# EAGLE design h2oiq_rev2 (EAGLE 6.3)
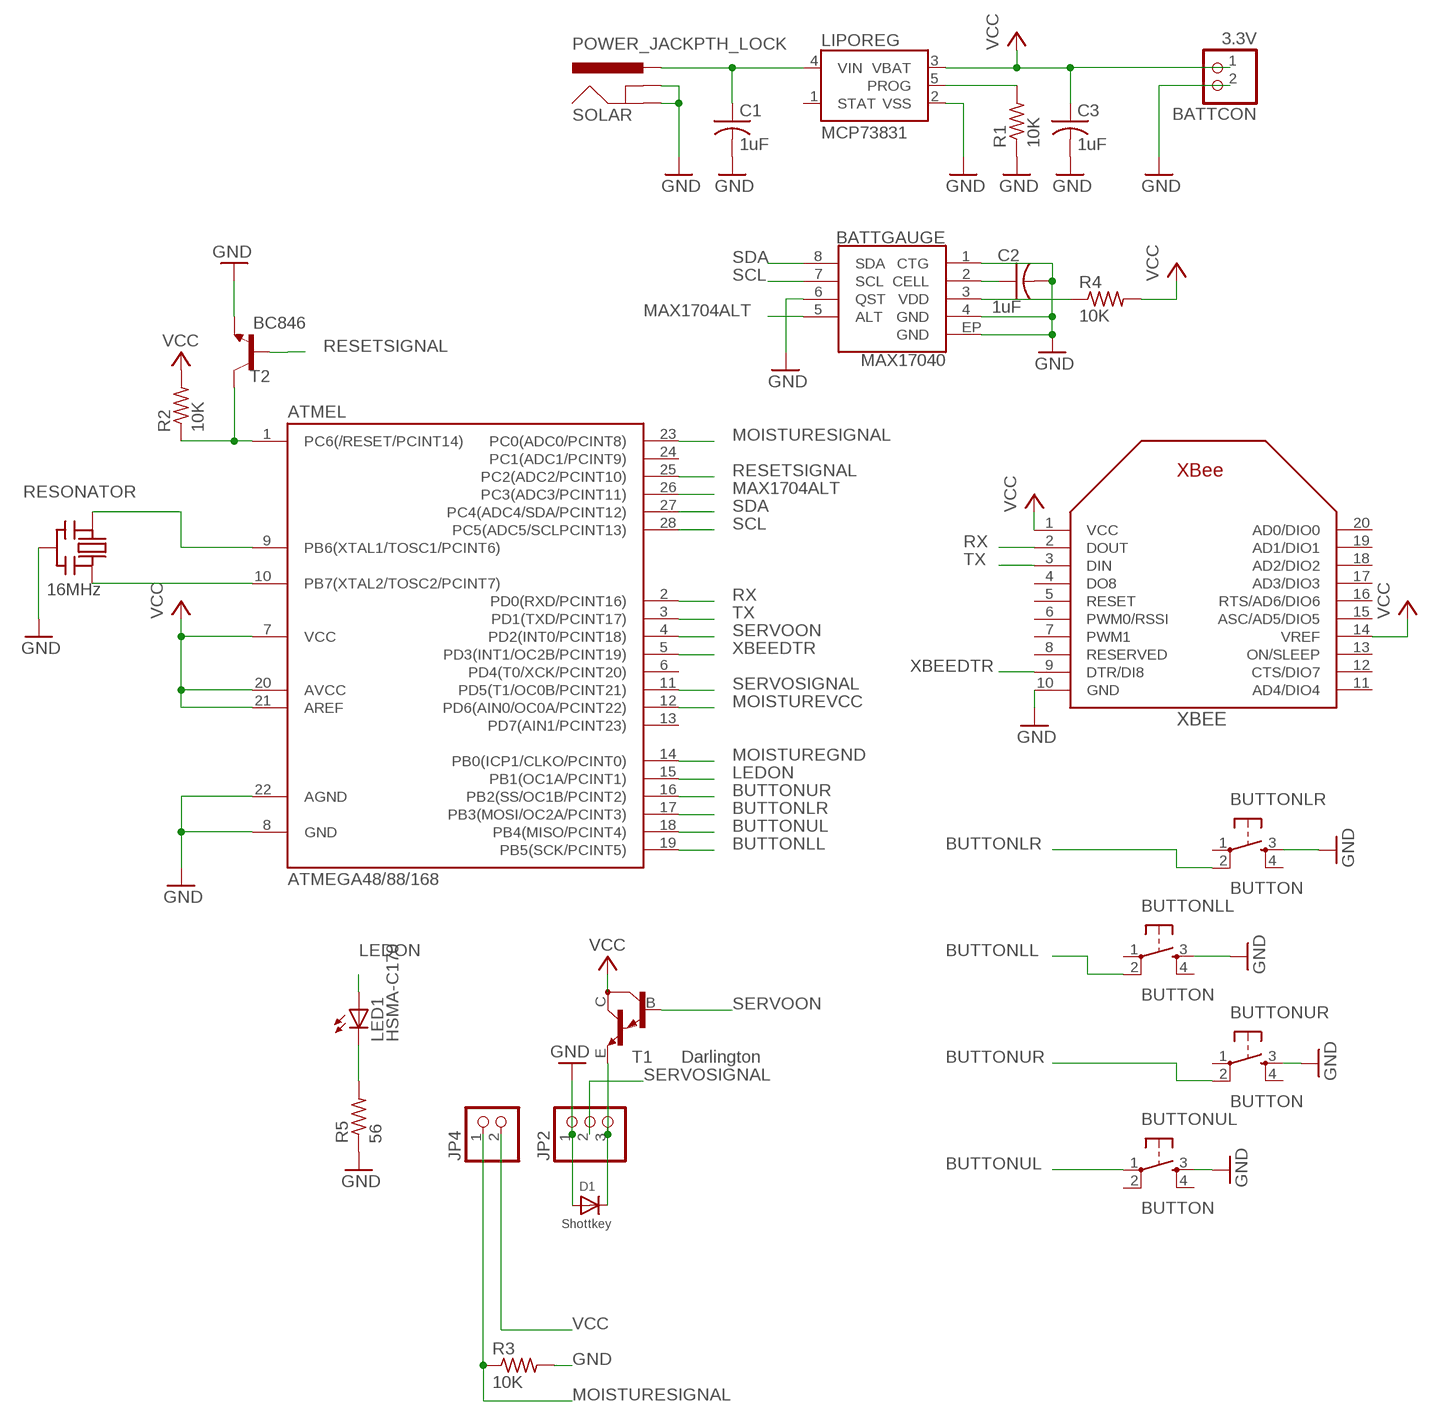
[diagram p0: schematic, sheet 1]

## Parts
ATMEL  ATMEGA48/88/168  MEGA48/88/168-PU  [DIL28-3]
BATTCON  3.3V  JST_2PIN-THM  [JST-PH-2-THM]
BATTGAUGE  MAX17040  [MAX17040-TFDN]
BUTTONLL  BUTTON  TAC_SWITCHPTH  [TACTILE-PTH]
BUTTONLR  BUTTON  TAC_SWITCHPTH  [TACTILE-PTH]
BUTTONUL  BUTTON  TAC_SWITCHPTH  [TACTILE-PTH]
BUTTONUR  BUTTON  TAC_SWITCHPTH  [TACTILE-PTH]
C1  1uF  C-USC0603K  [C0603K]
C2  1uF  C-USC0603K  [C0603K]
C3  1uF  C-USC0603K  [C0603K]
D1  Shottkey  DIODESMA  [SMADIODE]
JP2  PINHD-1X3  [1X03]
JP4  PINHD-1X2  [1X02]
LED1  HSMA-C170  LED-HSMA-C170  [LED-HSMA-SMD]
LIPOREG  MCP73831  [SOT23-5]
R1  10K  R-US_R0805  [R0805]
R2  10K  R-US_R0805  [R0805]
R3  10K  R-US_R0805  [R0805]
R4  10K  R-US_R0805  [R0805]
R5  56  R-US_R0805  [R0805]
RESONATOR  16MHz  CERMOSCILL-THM  [CERM_OSC]
SOLAR  POWER_JACKPTH_LOCK  [POWER_JACK_PTH_LOCK]
T1  Darlington  MMBTA13LT1-NPN_DARL-SOT23-BEC  [SOT23-BEC]
T2  BC846  [SOT23]
XBEE  XBEE  [XBEE]

## Nets
BUTTONLL: ATMEL.19(PB5(SCK/PCINT5)) BUTTONLL.2
BUTTONLR: ATMEL.17(PB3(MOSI/OC2A/PCINT3)) BUTTONLR.2
BUTTONUL: ATMEL.18(PB4(MISO/PCINT4)) BUTTONUL.1
BUTTONUR: ATMEL.16(PB2(SS/OC1B/PCINT2)) BUTTONUR.2
GND: ATMEL.8(GND) ATMEL.22(AGND) BATTCON.2 BATTGAUGE.1(CTG) BATTGAUGE.4(GND) BATTGAUGE.6(QST) BATTGAUGE.EP(GND) BUTTONLL.3 BUTTONLR.3 BUTTONUL.3 BUTTONUR.3 C1.2 C2.2 C3.2 D1.A JP2.1 LIPOREG.2(VSS) R1.1 R3.2 R5.1 RESONATOR.P$2(GND) SOLAR.GND SOLAR.GNDBREAK T2.2(E) XBEE.10(GND)
LEDON: ATMEL.15(PB1(OC1A/PCINT1)) LED1.P$1(A)
MAX1704ALT: ATMEL.26(PC3(ADC3/PCINT11)) BATTGAUGE.5(ALT)
MOISTUREGND: ATMEL.14(PB0(ICP1/CLKO/PCINT0))
MOISTURESIGNAL: ATMEL.23(PC0(ADC0/PCINT8)) JP4.1 R3.1
MOISTUREVCC: ATMEL.12(PD6(AIN0/OC0A/PCINT22))
N$1: BATTGAUGE.3(VDD) R4.1
N$2: LIPOREG.5(PROG) R1.2
N$3: ATMEL.1(PC6(/RESET/PCINT14)) R2.1 T2.3(C)
N$4: ATMEL.10(PB7(XTAL2/TOSC2/PCINT7)) RESONATOR.P$3(OUT)
N$6: ATMEL.9(PB6(XTAL1/TOSC1/PCINT6)) RESONATOR.P$1(IN)
N$11: LED1.P$2(C) R5.2
N$23: BATTGAUGE.2(CELL) C2.1
RESETSIGNAL: ATMEL.25(PC2(ADC2/PCINT10)) T2.1(B)
RX: ATMEL.2(PD0(RXD/PCINT16)) XBEE.2(DOUT)
SCL: ATMEL.28(PC5(ADC5/SCLPCINT13)) BATTGAUGE.7(SCL)
SDA: ATMEL.27(PC4(ADC4/SDA/PCINT12)) BATTGAUGE.8(SDA)
SERVOACT: D1.C JP2.3 T1.E
SERVOON: ATMEL.4(PD2(INT0/PCINT18)) T1.B
SERVOSIGNAL: ATMEL.11(PD5(T1/OC0B/PCINT21)) JP2.2
TX: ATMEL.3(PD1(TXD/PCINT17)) XBEE.3(DIN)
VCC: ATMEL.7(VCC) ATMEL.20(AVCC) ATMEL.21(AREF) BATTCON.1 C3.1 JP4.2 LIPOREG.3(VBAT) R2.2 R4.2 T1.C XBEE.1(VCC) XBEE.14(VREF)
VIN: C1.1 LIPOREG.4(VIN) SOLAR.PWR
XBEEDTR: ATMEL.5(PD3(INT1/OC2B/PCINT19)) XBEE.9(DTR/DI8)
Unconnected: ATMEL.6(PD4(T0/XCK/PCINT20)) ATMEL.13(PD7(AIN1/PCINT23)) ATMEL.24(PC1(ADC1/PCINT9)) BUTTONLL.1 BUTTONLL.4 BUTTONLR.1 BUTTONLR.4 BUTTONUL.2 BUTTONUL.4 BUTTONUR.1 BUTTONUR.4 LIPOREG.1(STAT) XBEE.4(DO8) XBEE.5(RESET) XBEE.6(PWM0/RSSI) XBEE.7(PWM1) XBEE.8(RESERVED) XBEE.11(AD4/DIO4) XBEE.12(CTS/DIO7) XBEE.13(ON/SLEEP) XBEE.15(ASC/AD5/DIO5) XBEE.16(RTS/AD6/DIO6) XBEE.17(AD3/DIO3) XBEE.18(AD2/DIO2) XBEE.19(AD1/DIO1) XBEE.20(AD0/DIO0)

## Library data of the parts
ATMEL = avr-4:MEGA48/88/168-PU
BATTCON = adafruit:JST_2PIN: JST 2-Pin Connectors of various flavors SMT-RA (S2B-PH-SM4) 4UConnector #17311 SMT (B2B-PH-SM4) THM-RA (S2B-PH) THM (B2B-PH)
BATTGAUGE = fuge_h20iq:MAX17040: LiPo Charge Regulator MAX17040 Maxim Integrated Products - TFDN-8 Package Source: http://datasheets.maximintegrated.com/en/ds/MAX17040-MAX17041.pdf
BUTTONLL BUTTONLR BUTTONUL BUTTONUR = SparkFun:TAC_SWITCH: Momentary Switch Button commonly used for reset or general input. Spark Fun Electronics SKU : COM-00097
C1-C3 = rcl:C-US: CAPACITOR, American symbol
D1 = adafruit:DIODE: Diode SMADIODE - SMA Surface Mount Package 20V 1A Schottky Diode Digikey: 641-1014-6-ND DO-1N4148 - Through Hole Small Current Diode SOD-123 20V 1 A (.5mV Vf) Schottky Diode - Digikey: MBRX120TPMSCT-ND SOD-323 10V 570mA (.38mV Vf, 3ns) Schottky Diode - Digikey: ZLLS410CT-ND SOD-523 30V 30mA Schottky Diode (RB751S-40TE61) - Digikey: RB751S-40TE61CT-ND SOT23-R/W - SOT23 Package (R = Solder Paste/Reflow Ovens, W = Hand-Soldering) BAT54Film 40V 300mA - Digikey: 497-7162-1-ND
JP2 = pinhead:PINHD-1X3: PIN HEADER
JP4 = pinhead:PINHD-1X2: PIN HEADER
LED1 = fuge_h20iq:LED-HSMA-C170: LED-HSMA Source: http://www.avagotech.com/docs/AV02-0112EN
LIPOREG = SparkFun:MCP73831: Microchip's MCP73831 Miniature single cell, fully integrated Li-Ion, Li-polymer charge management controller http://ww1.microchip.com/downloads/en/DeviceDoc/21984a.pdf
R1-R5 = resistor:R-US_: RESISTOR, American symbol
RESONATOR = adafruit:CERMOSCILL: Ceramic oscillator with built in capacitors such as ZTT-12MHz http://www.ladyada.net/library/eagle
SOLAR = SparkFun:POWER_JACK: Power Jack This is the standard 5.5mm barrel jack for power. The PTH is the most common, proven, reliable, footprint. All others are experimental. The Slot footprint only works if the mill layer is transmitted to the PCB fab house so be warned. Spark Fun Electronics SKU : PRT-00119. Mating wall wart : TOL-00298 (and others)
T1 = transistor:*-NPN_DARL-: NPN Darlington Transistor
T2 = transistor:BC846: NPN TRANSISTOR
XBEE = adafruit:XBEE

## Board
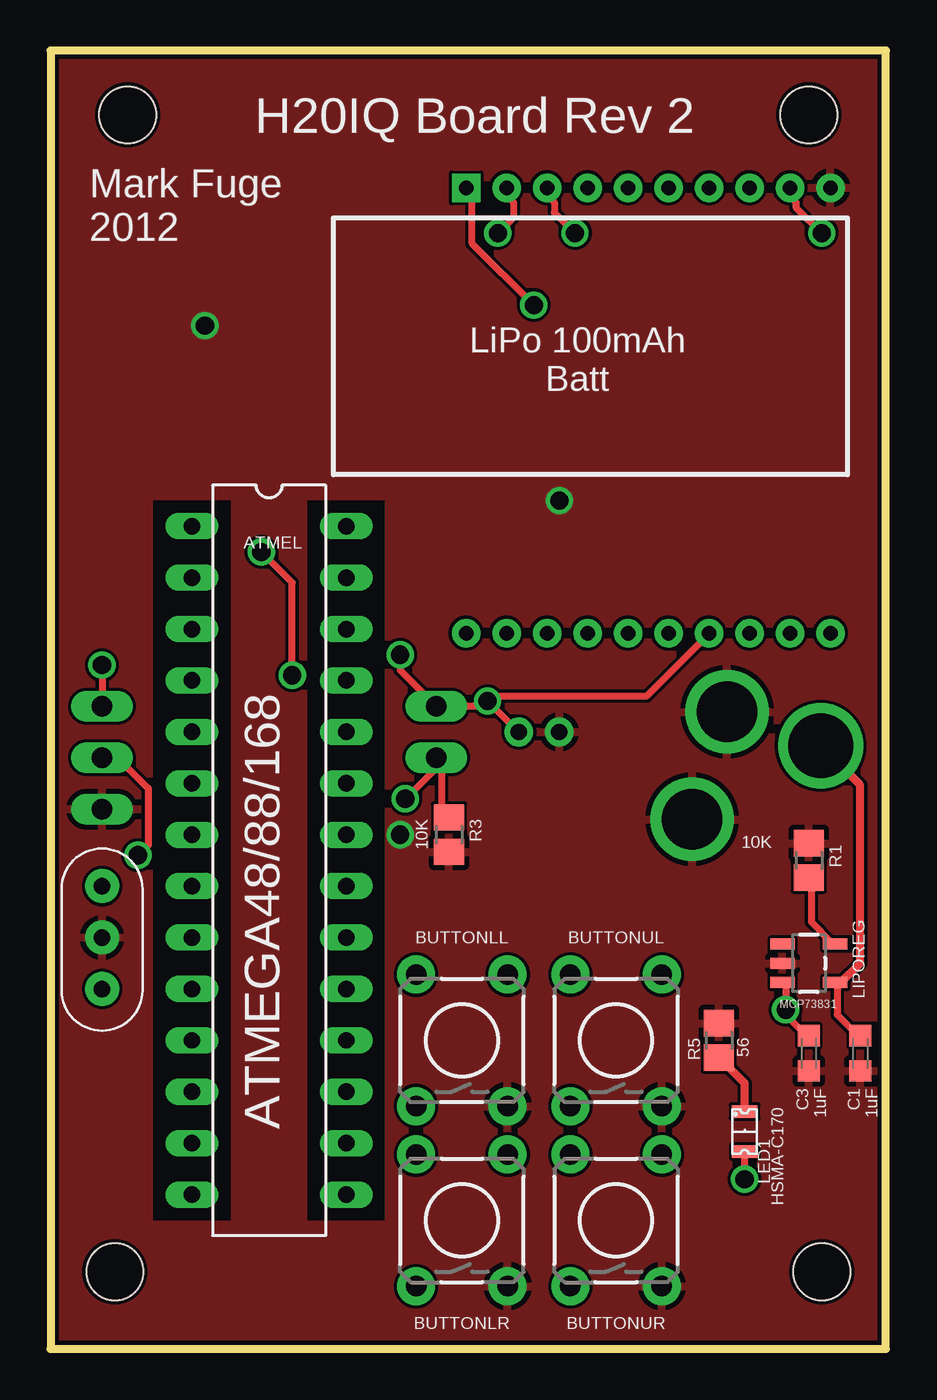
[diagram p1: board, top side]
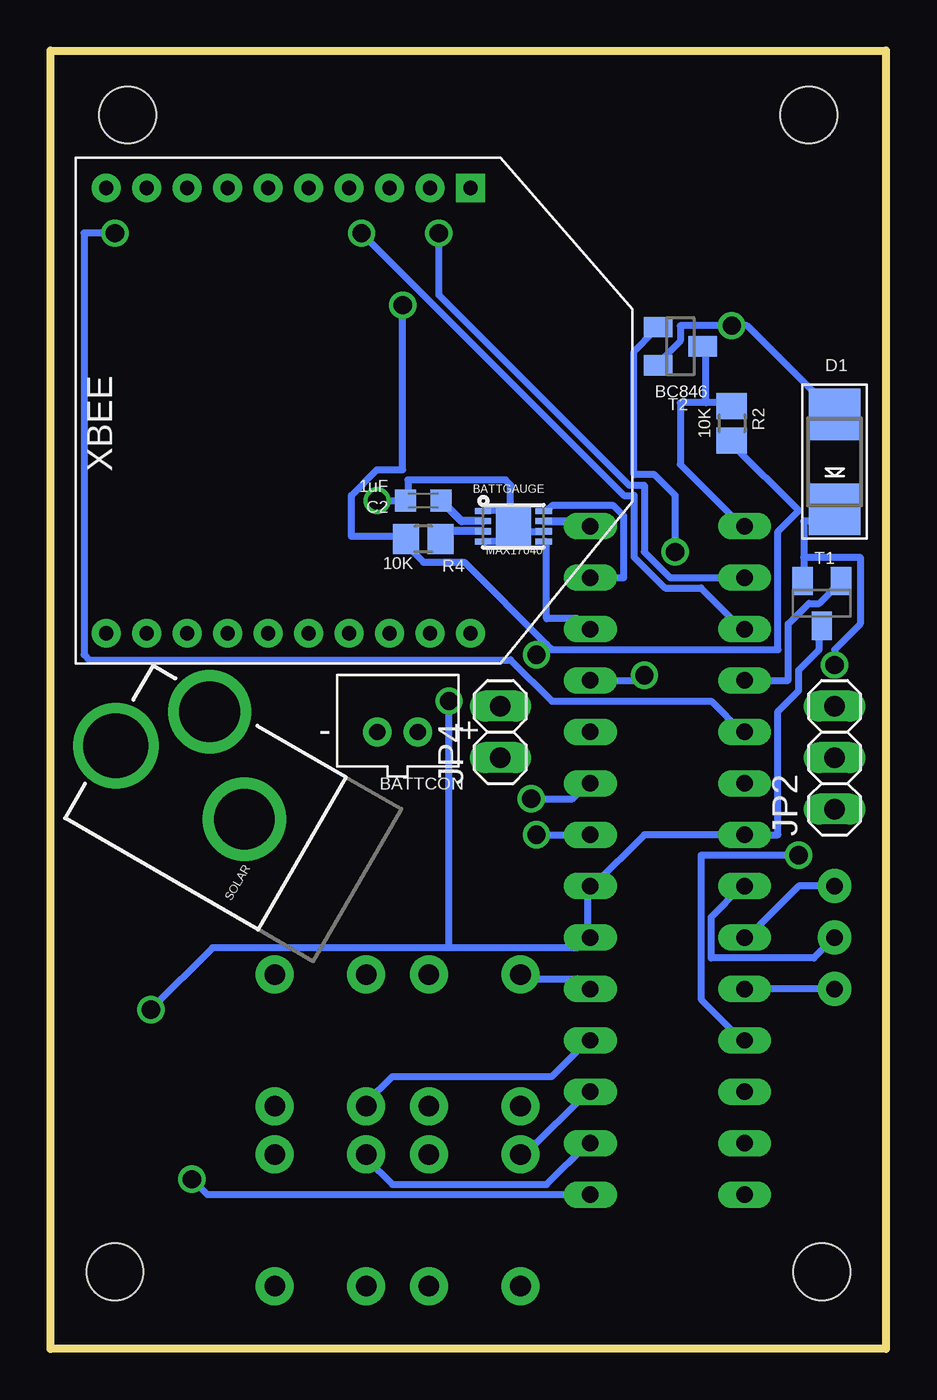
[diagram p2: board, bottom side, seen from below]

Size 41.27 x 64.14 mm. Coordinates in mm from the lower left corner, seen from the top.
Outline: 0,0 41.27,0 41.27,64.14 0,64.14 0,0
Copper layers (1*16): Top 0.035559375mm / dielectric 1.501140625mm / Bottom 0.035559375mm
Design rules "standard_design": minimum track width 14mil, minimum drill 0.899159375mm, track to track 6mil, track to pad 6mil, pad to pad 6mil, via to via 8mil, smd to smd 6mil, copper to edge 8mil, drill to drill 8mil, minimum pad ring 10mil, minimum via ring 8mil, stop-mask expansion 4mil, vias tented up to drill 0mil, thermal gap 10mil
Holes 2.8 mm at 3.81,60.96 37.47,60.96 3.17,3.81 38.1,3.81
tRestrict: area 5.1,6.4 to 8.9,41.9; area 12.7,6.4 to 16.5,41.9
bRestrict: area 19,55.9 to 40.6,58.4; area 19.1,34.3 to 39.4,36.8; area 22.2,29.2 to 26,31.8; area 17.8,27.9 to 20.3,33; area 1.3,25.4 to 3.8,33; area 24.3,20.1 to 39.2,33.2

### Footprints (pad centres in the part's own frame; a part is rotated, then mirrored left to right if it is on the bottom)
DIL28-3 = drill 0.813 long: 1 -16.51,-3.81; 2 -13.97,-3.81; 3 -11.43,-3.81; 4 -8.89,-3.81; 5 -6.35,-3.81; 6 -3.81,-3.81; 7 -1.27,-3.81; 8 1.27,-3.81; 9 3.81,-3.81; 10 6.35,-3.81; 11 8.89,-3.81; 12 11.43,-3.81; 13 13.97,-3.81; 14 16.51,-3.81; 15 16.51,3.81; 16 13.97,3.81; 17 11.43,3.81; 18 8.89,3.81; 19 6.35,3.81; 20 3.81,3.81; 21 1.27,3.81; 22 -1.27,3.81; 23 -3.81,3.81; 24 -6.35,3.81; 25 -8.89,3.81; 26 -11.43,3.81; 27 -13.97,3.81; 28 -16.51,3.81
JST-PH-2-THM = drill 0.8 pad 1.422: 1 1,0; 2 -1,0
MAX17040-TFDN = smd 0.8 x 0.3: 1 -1.5,0.75; 2 -1.5,0.25; 3 -1.5,-0.25; 4 -1.5,-0.75; 5 1.5,-0.75; 6 1.5,-0.25; 7 1.5,0.25; 8 1.5,0.75 | smd 1.73 x 1.88: EP 0,0
TACTILE-PTH = drill 1.016 pad 1.88: 1 -3.251,2.261; 2 3.251,2.261; 3 -3.251,-2.261; 4 3.251,-2.261
C0603K = smd 1.05 x 1.08: 1 -0.875,0; 2 0.875,0
SMADIODE = smd 2.54 x 2.54: A 2.349,0; C -2.349,0
1X03 = drill 1.016 long: 1 -2.54,0; 2 0,0; 3 2.54,0
1X02 = drill 1.016 long: 1 -1.27,0; 2 1.27,0
LED-HSMA-SMD = smd 1.27 x 0.635: P$1 0.01,0.22; P$2 0,2.2
SOT23-5 = smd 0.55 x 1.2: 1 -0.95,-1.3; 2 0,-1.3; 3 0.95,-1.3; 4 0.95,1.3; 5 -0.95,1.3
R0805 = smd 1.3 x 1.5: 1 -0.85,0; 2 0.85,0
CERM_OSC = drill 0.813 pad 1.676: P$1 -2.54,0; P$2 0,0; P$3 2.54,0
POWER_JACK_PTH_LOCK = drill 2.997 pad 4.115: GND 0.025,6.557; GNDBREAK 3.762,10.7 | drill 3.2 pad 4.115: PWR 0,13.878
SOT23-BEC = smd 1 x 1.4: B -0.95,-1.1; C 0,1.1; E 0.95,-1.1
SOT23 = smd 1 x 1.4: 1 -0.95,-1.1; 2 0.95,-1.1; 3 0,1.1
XBEE = drill 0.7 pad 1.422 square: 1 -11,5.5 | drill 0.7 pad 1.422: 2 -11,3.5; 3 -11,1.5; 4 -11,-0.5; 5 -11,-2.5; 6 -11,-4.5; 7 -11,-6.5; 8 -11,-8.5; 9 -11,-10.5; 10 -11,-12.5; 11 11,-12.5; 12 11,-10.5; 13 11,-8.5; 14 11,-6.5; 15 11,-4.5; 16 11,-2.5; 17 11,-0.5; 18 11,1.5; 19 11,3.5; 20 11,5.5

### Placement (x,y rotation side)
ATMEL  10.79,24.13 270 top
BATTCON  24.13,30.48 0 bottom
BATTGAUGE  18.41,40.64 0 bottom
BUTTONLL  20.32,15.24 90 top
BUTTONLR  20.32,6.35 90 top
BUTTONUL  27.94,15.24 90 top
BUTTONUR  27.94,6.35 90 top
C1  40.01,14.61 270 top
C2  22.86,41.91 180 bottom
C3  37.47,14.61 270 top
D1  2.54,43.81 90 bottom
JP2  2.54,29.21 90 bottom
JP4  19.05,30.48 90 bottom
LED1  34.29,9.53 0 top
LIPOREG  37.47,19.05 270 top
R1  37.47,24.13 270 top
R2  7.62,45.72 270 bottom
R3  19.68,25.4 270 top
R4  22.86,40.01 180 bottom
R5  33.02,15.24 270 top
RESONATOR  2.54,20.32 270 top
SOLAR  26.04,22.86 60 bottom
T1  3.17,36.83 180 bottom
T2  10.16,49.53 270 bottom
XBEE  26.04,46.35 270 bottom

### Tracks (layer width: path | path; a pad name or v marks a point on that pad's centre or on a via)
BUTTONLL
  Bottom 0.356: ATMEL.19 14.73,17.78 15.24,18.29 18.03,18.29 BUTTONLL.2
BUTTONLR
  Top 0.406: BUTTONLR.2 17.7,9.6
  Bottom 0.356: ATMEL.17 14.73,12.7 17.78,9.65 18.03,9.65 BUTTONLR.2
BUTTONUL
  Bottom 0.356: ATMEL.18 14.73,15.24 16.51,13.46 24.38,13.46 25.65,12.19 BUTTONUL.1
BUTTONUR
  Bottom 0.356: ATMEL.16 14.73,10.16 16.76,8.13 24.38,8.13 25.65,9.4 BUTTONUR.2
GND  (via drill 0.9)
  Bottom 0.356: T2.2 11.18,48.77 10.16,49.78 10.16,50.55 v7.62,50.55 6.86,50.55 2.54,46.23 D1.A | RESONATOR.P$2 3.56,19.3 8.64,19.3 8.64,21.34 7.11,22.86 ATMEL.8 | v25.15,41.91 C2.2 23.62,41.91 23.62,42.93 18.8,42.93 18.54,42.67 18.54,41.4 | 18.54,40.39 17.02,40.39 BATTGAUGE.6 | 18.54,40.64 18.54,40.39 | 18.54,40.39 18.54,39.88 19.81,39.88 BATTGAUGE.4 | 18.54,40.39 BATTGAUGE.EP | 18.54,41.4 19.81,41.4 BATTGAUGE.1 | 18.54,40.64 18.54,41.4 | 18.54,40.64 BATTGAUGE.EP | 18.54,41.4 BATTGAUGE.EP | v17.27,25.4 ATMEL.22
  pour Top: -1.27,64.77 -1.27,-1.27 41.91,-1.27 41.91,64.77
LEDON  (via drill 0.9)
  Top 0.356: v34.29,8.38 34.29,9.65 LED1.P$1
  Bottom 0.356: v34.29,8.38 33.53,7.62 ATMEL.15
MAX1704ALT
  Bottom 0.356: BATTGAUGE.5 16.76,39.88 16.76,36.07 15.24,36.07 14.73,35.56 ATMEL.26
MOISTURESIGNAL  (via drill 0.9)
  Top 0.356: 19.3,28.96 19.3,26.67 19.56,26.42 R3.1 | 19.3,28.96 v17.53,27.18 | 19.3,28.96 JP4.1
  Bottom 0.356: v17.53,27.18 15.49,27.18 14.73,27.94 ATMEL.23
N$1
  Bottom 0.406: BATTGAUGE.3 21.62,40.39 R4.1
N$2
  Top 0.356: LIPOREG.5 38.61,20.07 37.59,21.08 37.59,23.11 R1.2
N$3
  Bottom 0.356: 8.89,46.74 8.89,49.53 T2.3 | 8.89,46.74 7.62,46.74 R2.1 | 8.89,46.74 10.16,46.74 10.16,43.69 7.11,40.64 ATMEL.1
N$4
  Bottom 0.356: RESONATOR.P$3 ATMEL.10
N$6
  Bottom 0.356: RESONATOR.P$1 4.32,22.86 6.86,20.32 ATMEL.9
N$11
  Top 0.406: LED1.P$2 34.29,13.12 R5.2
N$23
  Bottom 0.406: BATTGAUGE.2 20.96,40.89 C2.1
RESETSIGNAL  (via drill 0.9)
  Top 0.356: v10.41,39.37 11.94,37.85 v11.94,33.27
  Bottom 0.356: v10.41,39.37 10.41,42.16 11.43,43.18 12.45,43.18 12.45,49.28 11.43,50.29 T2.1 | v11.94,33.27 12.19,33.02 ATMEL.25
RX  (via drill 0.9)
  Top 0.356: v22.1,55.12 22.86,55.88 22.86,56.64 22.61,56.9 22.61,57.15 XBEE.2
  Bottom 0.356: ATMEL.2 10.67,38.1 11.94,39.37 11.94,42.67 12.7,42.67 22.1,52.07 v22.1,55.12
SCL
  Bottom 0.406: BATTGAUGE.7 14.86,40.89 ATMEL.28
SDA
  Bottom 0.356: ATMEL.27 12.95,38.1 12.95,41.15 13.46,41.66 16.51,41.66 16.76,41.4 BATTGAUGE.8
SERVOACT  (via drill 0.9)
  Top 0.356: v2.54,33.78 JP2.3
  Bottom 0.356: 4.06,39.12 4.06,40.89 3.05,40.89 2.54,41.4 D1.C | 4.06,39.12 4.06,38.1 T1.E | v2.54,33.78 2.54,34.54 1.27,35.81 1.27,39.12 4.06,39.12
SERVOON
  Bottom 0.356: ATMEL.4 4.83,33.02 4.83,35.81 3.81,36.83 3.3,36.83 2.29,37.85 T1.B
SERVOSIGNAL  (via drill 0.9)
  Top 0.356: v4.32,24.38 4.83,24.89 4.83,27.69 3.3,29.21 JP2.2
  Bottom 0.356: v4.32,24.38 9.14,24.38 9.14,17.27 7.11,15.24 ATMEL.11
TX  (via drill 0.9)
  Top 0.356: v25.91,55.12 24.89,56.13 24.89,56.64 24.64,56.9 24.64,57.15 XBEE.3
  Bottom 0.356: v25.91,55.12 12.95,42.16 12.45,42.16 12.45,39.12 10.92,37.59 9.14,37.59 7.11,35.56 ATMEL.3
VCC  (via drill 0.9)
  Top 0.356: v23.88,51.56 20.83,54.61 20.83,56.9 20.57,57.15 XBEE.1 | 21.84,31.75 23.11,30.48 BATTCON.1 | 21.59,31.75 JP4.2 17.27,33.53 v17.27,34.29 | 21.59,31.75 21.84,31.75 | 21.84,31.75 21.84,32.26 29.46,32.26 32.51,35.31 XBEE.14 | C3.1 37.34,15.49 36.32,16.51 v36.32,16.76 36.32,18.03 LIPOREG.3 | v21.59,32 21.59,31.75
  Bottom 0.356: R2.2 7.62,44.7 4.32,41.4 5.33,40.39 5.33,34.54 16.51,34.54 16.76,34.8 | v23.88,51.56 23.88,43.43 25.15,43.43 26.42,42.16 26.42,40.13 23.88,40.13 R4.2 23.88,39.88 22.86,38.86 20.83,38.86 16.76,34.8 | v36.32,16.76 33.27,19.81 21.59,19.81 | 21.59,19.81 15.24,19.81 14.73,20.32 | 14.73,20.32 14.73,22.86 ATMEL.21 14.48,22.86 11.94,25.4 ATMEL.7 5.33,25.4 5.33,31.5 4.32,32.51 4.32,33.53 3.3,34.54 3.3,35.56 T1.C | 14.73,20.32 ATMEL.20 | 21.59,19.81 v21.59,32 | 16.76,34.8 v17.27,34.29
VIN
  Top 0.356: C1.1 39.88,15.49 38.86,16.51 38.86,18.03 LIPOREG.4
  Top 0.406: LIPOREG.4 39.05,18.1 40.01,19.05 40.01,27.85 SOLAR.PWR
XBEEDTR  (via drill 0.9)
  Top 0.356: v38.1,55.12 36.83,56.39 36.83,56.64 36.58,56.9 36.58,57.15 XBEE.9
  Bottom 0.356: v38.1,55.12 39.62,55.12 39.62,34.29 39.37,34.04 18.54,34.04 16.51,32 8.64,32 7.11,30.48 ATMEL.5

### Text on the board
tPlace: H20IQ Board Rev 2 | Mark Fuge / 2012 | LiPo 100mAh / Batt